# Altium project JacdacRgbBar8Ec30 122.PrjPCB
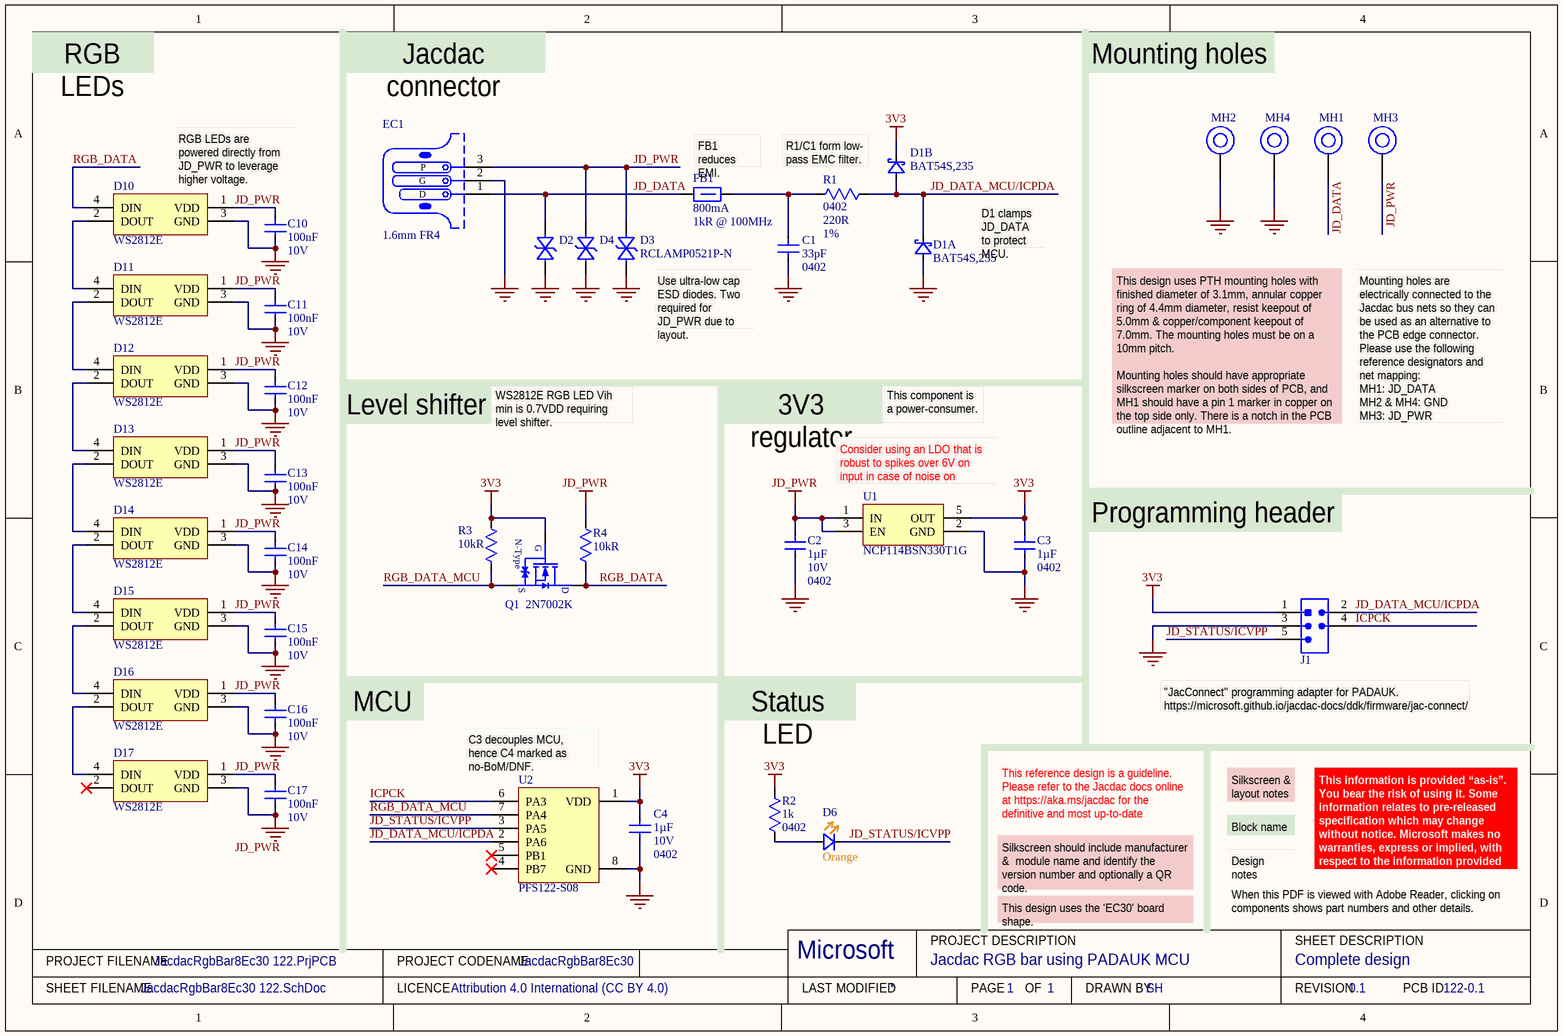
[diagram p0: JacdacRgbBar8Ec30 122.SchDoc]
ProjectCodeName: JacdacRgbBar8Ec30; ProjectCodenameDescription: Jacdac RGB bar using PADAUK MCU; ProjectCodenameID: 122; ProjectDrawnBy: SH; ProjectLicenceTerms: Attribution 4.0 International (CC BY 4.0); ProjectRevision: 0.1
1 sheet, 39 parts. Net scope: global (net labels, ports and power ports of the same name join across sheets).
Board files: JacdacRgbBar8Ec30 122.PcbDoc, JacdacRgbBar8Ec30 alt 1 122.PcbDoc

## Sheet JacdacRgbBar8Ec30 122.SchDoc: Complete design
size A4; DrawnBy: SH; DocumentNumber: 1; Revision: 0.1; SheetNumber: 1; SheetTotal: 1; VersionControl_RevNumber: 1

### Parts
C1  Case Code (Imperial): 0402  Capacitance: 33pF  [C0402_0.55MM - without outline]  (hidden comment: CL05C330JB5NNNC)
C2  Capacitance: 1µF  Voltage Rating: 10V  Case Code (Imperial): 0402  [C0402_0.55MM - without outline]  (hidden comment: CL05A105KP5NNNC)
C3  Capacitance: 1µF  Case Code (Imperial): 0402  [C0402_0.55MM - without outline]  (hidden comment: CL05A105KP5NNNC)
C4  Capacitance: 1µF  Voltage Rating: 10V  Case Code (Imperial): 0402  [C0402_0.55MM - without outline]  (hidden comment: CL05A105KP5NNNC)  (no BOM)
C10  Capacitance: 100nF  Voltage Rating: 10V  [C0402_0.55MM - without outline]  (hidden comment: CL05B104KP5NNNC)
C11  Capacitance: 100nF  Voltage Rating: 10V  [C0402_0.55MM - without outline]  (hidden comment: CL05B104KP5NNNC)
C12  Capacitance: 100nF  Voltage Rating: 10V  [C0402_0.55MM - without outline]  (hidden comment: CL05B104KP5NNNC)
C13  Capacitance: 100nF  Voltage Rating: 10V  [C0402_0.55MM - without outline]  (hidden comment: CL05B104KP5NNNC)
C14  Capacitance: 100nF  Voltage Rating: 10V  [C0402_0.55MM - without outline]  (hidden comment: CL05B104KP5NNNC)
C15  Capacitance: 100nF  Voltage Rating: 10V  [C0402_0.55MM - without outline]  (hidden comment: CL05B104KP5NNNC)
C16  Capacitance: 100nF  Voltage Rating: 10V  [C0402_0.55MM - without outline]  (hidden comment: CL05B104KP5NNNC)
C17  Capacitance: 100nF  Voltage Rating: 10V  [C0402_0.55MM - without outline]  (hidden comment: CL05B104KP5NNNC)
D1  Manufacturer Part Number: BAT54S,235  [NXP-BAT54S-TO-236AB - without outline]  (hidden comment: BAT54S)  (parts A,B of 2)
D2  RCLAMP0521P-N  [TVS 0402 - XL]  (value not drawn)
D3  RCLAMP0521P-N  [TVS 0402 - XL]
D4  RCLAMP0521P-N  [TVS 0402 - XL]  (value not drawn)
D6  Colour: Orange  [0603 Orange - without outline]  (hidden comment: 19-217/S2C-AQ1R1B/3T)
D10  WS2812E  [WS2812E-5050]
D11  WS2812E  [WS2812E-5050]
D12  WS2812E  [WS2812E-5050]
D13  WS2812E  [WS2812E-5050]
D14  WS2812E  [WS2812E-5050]
D15  WS2812E  [WS2812E-5050]
D16  WS2812E  [WS2812E-5050]
D17  WS2812E  [WS2812E-5050]
EC1  PCB Type: 1.6mm FR4  [JACDAC_EDGE_CONNECTOR_NO_TRACES]  (hidden comment: 3 pin JACDAC edge connector)  (no BOM)
FB1  Current Rating: 800mA  Impedance: 1kR @ 100MHz  [TDK MPZ1608 0.8mm - without outline]  (hidden comment: TDK MPZ1608S102ATA00)
J1  Hack Connect Mini 1.27 mm pitch 2-row  [HACK_CONNECT_MINI_5_X_1_27_0.559mm_TH]  (value not drawn)  (no BOM)
MH1  MH_7.0MMK_4.4MMC_3.1MMD_PTH  [MH_7.0MMK_4.4MMC_3.1MMD_PTH]  (value not drawn)  (no BOM)
MH2  MH_7.0MMK_4.4MMC_3.1MMD_PTH  [MH_7.0MMK_4.4MMC_3.1MMD_PTH]  (value not drawn)  (no BOM)
MH3  MH_7.0MMK_4.4MMC_3.1MMD_PTH  [MH_7.0MMK_4.4MMC_3.1MMD_PTH]  (value not drawn)  (no BOM)
MH4  MH_7.0MMK_4.4MMC_3.1MMD_PTH  [MH_7.0MMK_4.4MMC_3.1MMD_PTH]  (value not drawn)  (no BOM)
Q1  2N7002K  [SOT-23]
R1  Case Code (Imperial): 0402  Resistance: 220R  Tolerance: 1%  [R0402 - Without outline]  (hidden comment: RC0402FR-07220RL)
R2  Case Code (Imperial): 0402  Resistance: 1k  [R0402 - Without outline]  (hidden comment: RC0402FR-071KL)
R3  Resistance: 10kR  [R0402 - Without outline]  (hidden comment: 10k)
R4  Resistance: 10kR  [R0402 - Without outline]  (hidden comment: 10k)
U1  LDO 3.3V/300 mA  [ON_SEMI-SOT23-5 - without outline]  (value not drawn)
U2  PFS122-S08  [SOP-8]

### Nets
3V3: C3.2 C4.2 D1.2(K) J1.1(VCC) Q1.1(G) R2.2 R3.1 U1.5(OUT) U2.1(VDD)
GND: C1.1 C2.1 C3.1 C4.1 C10.1 C11.1 C12.1 C13.1 C14.1 C15.1 C16.1 C17.1 D1.1(A) D2.2(A) D3.2(A) D4.2(A) D10.3(GND) D11.3(GND) D12.3(GND) D13.3(GND) D14.3(GND) D15.3(GND) D16.3(GND) D17.3(GND) EC1.2(G) J1.3(GND) MH2.1 MH4.1 U1.2(GND) U2.8(GND)
JD_PWR: C2.2 C10.2 C11.2 C12.2 C13.2 C14.2 C15.2 C16.2 C17.2 D3.1(K) D4.1(K) D10.1(VDD) D11.1(VDD) D12.1(VDD) D13.1(VDD) D14.1(VDD) D15.1(VDD) D16.1(VDD) D17.1(VDD) EC1.3(P) MH3.1 R4.1 U1.1(IN) U1.3(EN)
ICPCK: J1.4(SWCLK) U2.6(PA3)
JD_DATA: D2.1(K) EC1.1(D) FB1.1 MH1.1
JD_DATA_MCU/ICPDA: D1.3(K) J1.2(SWDIO) R1.1 U2.2(PA6)
JD_STATUS/ICVPP: D6.1(K) J1.5(RESET) U2.3(PA5)
RGB_DATA: D10.4(DIN) Q1.3(D) R4.2
RGB_DATA_MCU: Q1.2(S) R3.2 U2.7(PA4)
NetC1_2: C1.2 FB1.2 R1.2
NetD6_2: D6.2(A) R2.1
NetD10_2: D10.2(DOUT) D11.4(DIN)
NetD11_2: D11.2(DOUT) D12.4(DIN)
NetD12_2: D12.2(DOUT) D13.4(DIN)
NetD13_2: D13.2(DOUT) D14.4(DIN)
NetD14_2: D14.2(DOUT) D15.4(DIN)
NetD15_2: D15.2(DOUT) D16.4(DIN)
NetD16_2: D16.2(DOUT) D17.4(DIN)

Not connected (* = marked no-connect by the designer): D17 2(DOUT)*; U2 4(PB7)* 5(PB1)*

### Notes on the sheet
- RGB LEDs
- Jacdac connector
- Mounting holes
- RGB LEDs are powered directly from JD_PWR to leverage higher voltage.
- (near FB1) FB1 reduces EMI.
- R1/C1 form low- pass EMC filter.
- D1 clamps JD_DATA to protect MCU.
- Use ultra-low cap ESD diodes. Two required for JD_PWR due to layout.
- Mounting holes are electrically connected to the Jacdac bus nets so they can be used as an alternative to the PCB edge connector. Please use the following reference designators and net mapping:
- Level shifter
- WS2812E RGB LED Vih min is 0.7VDD requiring level shifter.
- 3V3 regulator
- This component is a power-consumer.
- This design uses PTH mounting holes with finished diameter of 3.1mm, annular copper ring of 4.4mm diameter, resist keepout of 5.0mm & copper/component keepout of 7.0mm. The mounting holes must be on a 10mm pitch.
  Mounting holes should have appropriate silkscreen marker on both sides of PCB, and MH1 should have a pin 1 marker in copper on the top side only. There is a notch in the PCB outline adjacent to MH1.
- MH1: JD_DATA
  MH2 & MH4: GND
  MH3: JD_PWR
- (near U1) Consider using an LDO that is robust to spikes over 6V on input in case of noise on JD_PWR.
- Programming header
- MCU
- Status LED
- (near J1) "JacConnect" programming adapter for PADAUK.
  https://microsoft.github.io/jacdac-docs/ddk/firmware/jac-connect/
- (near U2) C3 decouples MCU, hence C4 marked as no-BoM/DNF.
- This reference design is a guideline. Please refer to the Jacdac docs online at https://aka.ms/jacdac for the definitive and most up-to-date information.
- Block name
- Silkscreen & layout notes
- This design uses the 'EC30' board shape.
- Silkscreen should include manufacturer &  module name and identify the version number and optionally a QR code.
- Design notes
- When this PDF is viewed with Adobe Reader, clicking on components shows part numbers and other details.
- This information is provided “as-is”. You bear the risk of using it. Some information relates to pre-released specification which may change without notice. Microsoft makes no warranties, express or implied, with respect to the information provided here.
- Labels drawn without touching a wire or pin: JD_PWR
- PROJECT FILENAME
- PROJECT CODENAME
- Microsoft
- PROJECT DESCRIPTION
- SHEET DESCRIPTION
- SHEET FILENAME
- LICENCE
- LAST MODIFIED
- PAGE
- OF
- DRAWN BY
- REVISION
- PCB ID
- (in symbol 2N7002K (2)) N-Type

### Library data of the parts
C1 = CL05C330JB5NNNC: CAP CER 33PF 50V C0G/NP0 0402; Manufacturer: Samsung; Material: Ceramic; Tolerance: 5%; Dielectric: C0G; Temperature Coefficient: 300ppm/°C; Supplier 1: Digi-Key; Manufacturer Part Number: CL05C330JB5NNNC; RoHS: Yes; Category: Ceramic Capacitors; Stock 1: 5436088; Pricing 1: 1=0.10000, 10=0.02300, 50=0.01260, 100=0.01040, 500=0.00740, 1000=0.00582, 2500=0.00529, 5000=0.00487 (USD); Mount: Surface Mount; Case Code (Metric): 1005; Contact Plating: Tin; Min Operating Temperature: -55°C; Max Operating Temperature: 125°C; Package Quantity: 1; Packaging: Tape and Reel; Voltage: 50V; Voltage Rating (DC): 50V; Series: CL; Construction: Flat; Length: 1mm; Width: 0.02inch; Height: 0.5mm; Thickness: 0.022inch; Depth: 0.5mm; Radiation Hardening: No; Lead Free: Lead Free; RoHS Compliant: Yes; ComponentLink1URL: https://datasheet.ciiva.com/15195/getdatasheetpartid-355282-15195687.pdf; ComponentLink1Description: Online datasheet; Supplier 2: Newark; Stock 2: 45340; Pricing 2: 1=0.12500, 25=0.02900, 100=0.01300, 250=0.01100, 500=0.00900, 1000=0.00600 (USD); Supplier 3: Mouser; Stock 3: 8877; Pricing 3: 1=0.10000, 10=0.01400, 50=0.01400, 100=0.01100, 1000=0.00600, 10000=0.00400 (USD); Supplier 4: Farnell; Stock 4: 10934; Pricing 4: 150=0.01120, 500=0.00860, 2500=0.00640, 5000=0.00550 (GBP); Supplier Part Number 4: 3013373RL; Supplier Part Number 3: 187-CL05C330JB5NNNC; Supplier Part Number 2: 82AC9259; Supplier Part Number 1: 1276-1272-1-ND; Voltage Rating: 50V; Case/Package: 0402
C2-C4 = CL05A105KP5NNNC: CAP CER 1UF 10V X5R 0402; Manufacturer: Samsung; Material: Ceramic; Tolerance: 10%; Supplier 1: Digi-Key; Manufacturer Part Number: CL05A105KP5NNNC; RoHS: Yes; Category: Capacitors; Stock 1: 5705569; Pricing 1: 1=0.10000, 10=0.03900, 50=0.02100, 100=0.01720, 500=0.01228, 1000=0.00965, 2500=0.00877, 5000=0.00807 (USD); Mount: Surface Mount; Case/Package: 0402; Case Code (Metric): 1005; Contact Plating: Tin; Min Operating Temperature: -55°C; Max Operating Temperature: 85°C; Dielectric: X5R; Package Quantity: 1; Packaging: Tape and Reel; Length: 1mm; Height: 0.5mm; Width: 0.02inch; Thickness: 0.022inch; Depth: 0.5mm; Radiation Hardening: No; ComponentLink1URL: https://datasheet.ciiva.com/15195/getdatasheetpartid-358390-15195630.pdf; ComponentLink1Description: Online datasheet; Supplier 2: Mouser; Stock 2: 928941; Pricing 2: 1=0.10000, 10=0.04200, 100=0.01800, 500=0.01300, 1000=0.01000, 2500=0.00900 (USD); Supplier 3: Farnell; Stock 3: 53670; Pricing 3: 10=0.02450, 100=0.02000, 500=0.01310, 2500=0.00920, 5000=0.00810, 10000=0.00640, 50000=0.00490 (GBP); Supplier Part Number 3: 3013329; Supplier Part Number 2: 187-CL05A105KP5NNNC; Supplier Part Number 1: 1276-1076-1-ND; Created: DG; Checked: ?
  C3: Voltage Rating: 10V
C10-C17 = CL05B104KP5NNNC: CAP CER 0.1UF 10V X7R 0402; Manufacturer: Samsung; Tolerance: 10%; Supplier 1: Digi-Key; Manufacturer Part Number: CL05B104KP5NNNC; RoHS: Yes; Category: Ceramic Capacitors; Stock 1: 17321183; Pricing 1: 1=0.10000, 10=0.02500, 50=0.01380, 100=0.01130, 500=0.00804, 1000=0.00632, 2500=0.00575, 5000=0.00529 (USD); Mount: Surface Mount; Case/Package: 0402; Case Code (Imperial): 0402; Case Code (Metric): 1005; Contact Plating: Tin; Min Operating Temperature: -55°C; Max Operating Temperature: 125°C; Package Quantity: 1; Packaging: Tape and Reel; Dielectric: X7R; Length: 1mm; Width: 0.02inch; Height: 0.5mm; Thickness: 0.022inch; Depth: 0.5mm; Radiation Hardening: No; ComponentLink1URL: https://datasheet.ciiva.com/15165/getdatasheetpartid-37100-15165107.pdf; ComponentLink1Description: Samsung datasheet online; Supplier 2: Mouser; Stock 2: 984124; Pricing 2: 10000=0.00400, 20000=0.00400, 50000=0.00400 (USD); Supplier 3: Farnell; Stock 3: 39022; Pricing 3: 10=0.01620, 100=0.01310, 500=0.00740, 2500=0.00600, 5000=0.00470, 10000=0.00400, 50000=0.00320 (GBP); Supplier 4: Newark; Stock 4: 56730; Pricing 4: 1=0.09000, 25=0.02300, 100=0.01000, 250=0.00900, 500=0.00700, 1000=0.00500, 2500=0.00500 (USD); Supplier 5: Future Electronics; Stock 5: 20877033; Pricing 5: 1=0.00460, 500=0.00340, 1500=0.00320, 2500=0.00310, 5000=0.00300 (USD); Supplier Part Number 5: 9032525; Supplier Part Number 4: 82AC9219; Supplier Part Number 2: 187-CL05B104KP5NNNC; Supplier Part Number 1: 1276-1002-1-ND; Created: DG; Checked: ?; Supplier Part Number 3: 3013351
D1 = BAT54S: DIODE ARRAY SCHOTTKY 30V SOT23; Manufacturer: Nexperia; Supplier 1: Digi-Key; RoHS: No; Category: Rectifier Diodes; Stock 1: 14011; Pricing 1: 1=0.13000, 10=0.11900, 100=0.05610, 500=0.03326, 1000=0.02185, 5000=0.02138 (USD); ComponentLink1URL: https://assets.nexperia.com/documents/data-sheet/BAT54_SER.pdf; ComponentLink1Description: NXP datasheet online; Supplier 2: Mouser; Supplier 3: RSComponents; Supplier Part Number 2: 771-BAT54S235; Supplier Part Number 3: 1707990; Supplier Part Number 1: 1727-1868-1-ND
D2-D4 = RCLAMP0521P-N: Bidirectional 5V (Max) 6V 16V 3.5A (8/20us) 0402 TVS RoHS; Manufacturer: Born Semiconductor; Package: 0402; Created By: D Gakure; Checked By: ?; Supplier1: LCSC; Supplier1 Part Number: C316043; ComponentLink1Description: Online datasheet; ComponentLink1URL: https://datasheet.lcsc.com/szlcsc/Bourne-Semicon-Shenzhen-RCLAMP0521P-N_C316043.pdf; Manufacturer Part Number: RCLAMP0521P-N
D6 = 19-217/S2C-AQ1R1B/3T: LED ORANGE DIFFUSED 1608 SMD; Manufacturer: Everlight Elec; Lens Color: White; Luminous Intensity: 100mcd; Test Current: 25mA; Dominant Wavelength: 605nm; Forward Voltage: 2.05V; Manufacturer Part Number: 19-217/S2C-AQ1R1B/3T; RoHS: Yes; Category: LEDs; Mount: Surface Mount; Case/Package: 0603; Color: Orange; Case Code (Metric): 1608; Case Code (Imperial): 0603; Lens Transparency: Diffused; Length: 1.6mm; Width: 0.8mm; Height: 0.65mm; Lead Free: Lead Free; ComponentLink1URL: https://datasheet.lcsc.com/lcsc/1912171731_Everlight-Elec-19-217-S2C-AQ1R1B-3T_C146215.pdf; ComponentLink1Description: Online datasheet; Supplier 1: LCSC; Supplier 1 Part Number: C146215
D10-D17 = WS2812E-5050: WS2812E 5050 RGB LED WITH INTEGRATED DRIVER; Manufacturer: Worldsemi; Color: Blue,Green,Red; Supplier 1 Part Number 3: C139127; RoHS: Yes; Category: LEDs; Mount: Surface Mount; Length: 5mm; Width: 5mm; ComponentLink1URL: https://datasheet.lcsc.com/lcsc/1811151230_Worldsemi-WS2812E_C139127.pdf; ComponentLink1Description: Online datasheet; Supplier 1: LCSC; Manufacturer Part Number: WS2812E
EC1 = Jacdac edge connector: 3 pin Jacdac edge connector 1.27mm pitch; Manufacturer Part Number: JACDAC_EDGE_CONNECTOR; Checked By: ?; Created By: D. Gakure; ComponentLink1Description: Yuliang JACDAC cable connector drawing online; ComponentLink1URL: https://github.com/microsoft/jacdac-mdk/blob/main/connector/JACDAC-Connector-by-Yuliang-2020-11-28.pdf; ComponentLink2Description: JACDAC PCB edge connector spec onlin; ComponentLink2URL: https://github.com/microsoft/jacdac-mdk/blob/main/connector/JACDAC_PCB_Edge_Connector_Drawing_JD-PEC-01_rev_01.pdf
FB1 = TDK MPZ1608S102ATA00: 0603 1k@100MHz 0.8A chip; Core Material: Ferrite; Tolerance: 25%; DC Resistance (DCR): 300mR; Supplier 1: Digi-Key; Stock 1: 113542; Pricing 1: 1=0.1, 10=0.079, 25=0.0716, 50=0.0644, 100=0.0472, 250=0.03432, 500=0.03146, 1000=0.02717 (USD); Mount: Surface Mount; Case/Package: 0603; Case Code (Metric): 1608; Case Code (Imperial): 0603; Package Quantity: 4000; Packaging: Tape and Reel; Max DC Current: 800mA; Length: 0.063inch; Height: 0.037inch; Width: 0.031inch; ComponentLink2URL: https://www.mouser.co.uk/datasheet/2/400/eads_commercial_power_mpz1608_en-923650.pdf; ComponentLink2Description: datasheet online; Supplier 2: Mouser; ComponentLink3Description: datasheet; ComponentLink3URL: Y:\System\Altium\Libraries 2014\TDK\Datasheets\eads_commercial_power_mpz1608_en-923650.pdf; Supplier Part Number 1: 445-8694-1-ND; Supplier Part Number 2: 810-MPZ1608S102ATA00; Manufacturer: TDK; Manufacturer Part Number: MPZ1608S102ATA00
J1 = HACK_CONNECT_MINI
MH1-MH4 = MH_7.0MMK_4.4MMC_3.1MMD_PTH: Mounting Hole 7.0mm keepout, 4.4mm annualar ring and 3.1mm Drill PTH; Hole Size: M3; Hole Diameter: 3.1mm; Hole Type: PTH; Annular Ring: 4.4mm; Hole Clearance: 7.0mm
Q1 = 2N7002K (2): MOSFET Transistor, N Channel, 300 mA, 60 V, 2 ohm, 10 V, 2.5 V; Manufacturer: ON Semiconductor / Fairchild; Continuous Drain Current (ID): 300mA; Power Dissipation: 350mW; Gate to Source Voltage (Vgs): 20V; Input Capacitance: 50pF; Drain to Source Resistance: 2R; Turn-Off Delay Time: 30ns; Drain to Source Breakdown Voltage: 60V; Number of Elements: 1; Turn-On Delay Time: 5ns; Element Configuration: Single; Threshold Voltage: 2.5V; Polarity: N-CHANNEL; Supplier 1: Digi-Key; RoHS: Yes; Category: MOSFETs; Stock 1: 53564; Pricing 1: 1=0.40000, 10=0.32500, 25=0.27240, 100=0.17240, 500=0.11344, 1000=0.07714 (USD); Mount: Surface Mount; Case/Package: SOT-23; Number of Pins: 3; Contact Plating: Tin,Matte; Min Operating Temperature: -55°C; Max Operating Temperature: 150°C; Packaging: Tape and Reel; Max Power Dissipation: 350mW; Package Quantity: 1; Rds On Max: 2R; Drain to Source Voltage (Vdss): 60V; On-State Resistance: 2R; Drain-source On Resistance-Max: 2R; Voltage: 60V; Length: 2.92mm; Width: 1.3mm; Height: 1.2mm; Radiation Hardening: No; Lead Free: Lead Free; REACH SVHC: No SVHC; Supplier 2: Mouser; Stock 2: 111825; Pricing 2: 1=0.40000, 10=0.27300, 50=0.27300, 100=0.13400, 1000=0.07800, 10000=0.05100 (USD); Supplier 3: Farnell; Stock 3: 101059; Pricing 3: 5=0.34800, 10=0.23500, 100=0.09100, 500=0.05850, 3000=0.04630, 9000=0.03860, 24000=0.03750, 45000=0.03530 (GBP); Supplier Part Number 3: 2453382; Supplier Part Number 1: 2N7002KCT-ND; Supplier Part Number 2: 512-2N7002K; Created By: D. Gakure; Checked By: ?; ComponentLink1Description: Online datasheet; ComponentLink1URL: https://www.onsemi.com/pdf/datasheet/2n7002k-d.pdf; Manufacturer Part Number: 2N7002K
R1 = RC0402FR-07220RL: RES SMD 220 OHM 1% 1/16W 0402; Manufacturer: Yageo; Power Rating: 62.5mW; Voltage Rating: 50V; Temperature Coefficient: 100ppm/°C; Max Power Dissipation: 63mW; Supplier 1: Digi-Key; Manufacturer Part Number: RC0402FR-07220RL; RoHS: Yes; Category: Resistors; Stock 1: 1286042; Pricing 1: 1=0.10000, 10=0.01400, 100=0.00580, 1000=0.00262, 2500=0.00228, 5000=0.00188 (USD); Case/Package: 0402; Number of Pins: 2; Case Code (Metric): 1005; Min Operating Temperature: -55°C; Max Operating Temperature: 155°C; Packaging: Tape and Reel; Voltage Rating (DC): 50V; Package Quantity: 1; Termination: SMD/SMT; Resistor Type: Thick Film; Number of Terminations: 2; Features: Moisture Resistant; Length: 1mm; Height: 0.016inch; Width: 0.02inch; Depth: 0.5mm; REACH SVHC: No SVHC; Military Standard: Not; Lead Free: Lead Free; ComponentLink1URL: https://datasheet.ciiva.com/11819/0900766b80c66297-11819466.pdf; ComponentLink1Description: Online datasheet; Supplier 2: Mouser; Stock 2: 324625; Pricing 2: 1=0.10000, 10=0.01200, 100=0.00400, 1000=0.00400, 2500=0.00400, 10000=0.00300 (USD); Supplier 3: Farnell; Stock 3: 18234; Pricing 3: 1=0.08130, 25=0.01210, 100=0.01120, 250=0.01030, 500=0.00900 (GBP); Supplier Part Number 3: 2147864; Supplier Part Number 2: 603-RC0402FR-07220RL; Supplier Part Number 1: 311-220LRCT-ND; Created: D.G; Checked: ?
R2 = RC0402FR-071KL: RES SMD 1K OHM 1% 1/16W 0402; Manufacturer: Yageo; Temperature Coefficient: 100ppm/°C; Voltage Rating (DC): 50V; Power Rating: 62.5mW; Supplier 1: Digi-Key; Manufacturer Part Number: RC0402FR-071KL; RoHS: Yes; Category: Resistors; Stock 1: 37591306; Pricing 1: 1=0.10000, 10=0.01400, 100=0.00580, 1000=0.00262, 2500=0.00228, 5000=0.00188 (USD); Case/Package: 0402; Number of Pins: 2; Case Code (Metric): 1005; Min Operating Temperature: -55°C; Max Operating Temperature: 155°C; Resistor Type: Thick Film; Tolerance: 1%; Packaging: Tape and Reel; Voltage Rating: 50V; Termination: SMD/SMT; Length: 1mm; Height: 0.32mm; Width: 0.5mm; Depth: 0.5mm; REACH SVHC: Unknown; Lead Free: Lead Free; Military Standard: Not; ComponentLink2URL: https://datasheet.ciiva.com/12666/pyu-rc0402-51-rohs-l-6-r-12666741.pdf; ComponentLink2Description: Online datasheet; Supplier 2: Mouser; Stock 2: 11912978; Pricing 2: 1=0.10000, 10=0.01200, 100=0.00400, 1000=0.00400, 2500=0.00400, 10000=0.00300 (USD); Supplier 3: Farnell; Stock 3: 29900; Pricing 3: 1=0.08130, 25=0.01210, 100=0.01120, 250=0.01030, 500=0.00900 (GBP); Supplier Part Number 3: 2132441; Supplier Part Number 2: 603-RC0402FR-071KL; Supplier Part Number 1: 311-1.00KLRDKR-ND; Created: D.G; Checked: ?
R3 R4 = RC0402FR-0710KL: RES SMD 10K OHM 1% 1/16W 0402; Manufacturer: Yageo; Temperature Coefficient: 100ppm/°C; Voltage Rating (DC): 50V; Power Rating: 62.5mW; Supplier 1: Digi-Key; Manufacturer Part Number: RC0402FR-0710KL; RoHS: Yes; Category: Resistors; Stock 1: 40173593; Pricing 1: 1=0.10000, 10=0.01400, 100=0.00580, 1000=0.00262, 2500=0.00228, 5000=0.00188 (USD); Case/Package: 0402; Number of Pins: 2; Case Code (Metric): 1005; Min Operating Temperature: -55°C; Max Operating Temperature: 155°C; Resistor Type: Thick Film; Packaging: Tape and Reel; Voltage Rating: 50V; Termination: SMD/SMT; Working Voltage: 50V; Number of Terminations: 2; Length: 1mm; Height: 0.32mm; Width: 0.5mm; Depth: 0.5mm; Lead Pitch: 0.2mm; REACH SVHC: No SVHC; Lead Free: Lead Free; Military Standard: Not; ComponentLink1URL: https://datasheet.ciiva.com/7660/38568-7660787.pdf?src-supplier=Element14; ComponentLink1Description: https://datasheet.ciiva.com/7660/38568-7660787.pdf?src-supplier=Element14; ComponentLink2URL: https://datasheet.ciiva.com/7849/1784430-7849813.pdf?src-supplier=Element14; ComponentLink2Description: https://datasheet.ciiva.com/7849/1784430-7849813.pdf?src-supplier=Element14; ComponentLink3URL: https://datasheet.ciiva.com/7849/1686128-7849814.pdf?src-supplier=Element14; ComponentLink3Description: https://datasheet.ciiva.com/7849/1686128-7849814.pdf?src-supplier=Element14; ComponentLink4URL: https://datasheet.ciiva.com/7849/1784430-7849815.pdf?src-supplier=Element14; ComponentLink4Description: https://datasheet.ciiva.com/7849/1784430-7849815.pdf?src-supplier=Element14; ComponentLink5URL: https://datasheet.ciiva.com/22747/1018594-22747512.pdf?src-supplier=Element14; ComponentLink5Description: https://datasheet.ciiva.com/22747/1018594-22747512.pdf?src-supplier=Element14; ComponentLink6URL: https://datasheet.ciiva.com/12667/pyu-rc0402-51-rohs-l-6-r-12667067.pdf?src-supplier=Mouser; ComponentLink6Description: https://datasheet.ciiva.com/12667/pyu-rc0402-51-rohs-l-6-r-12667067.pdf?src-supplier=Mouser; ComponentLink7URL: https://datasheet.ciiva.com/7983/1018594-7983486.pdf?src-supplier=Element14; ComponentLink7Description: https://datasheet.ciiva.com/7983/1018594-7983486.pdf?src-supplier=Element14; Supplier 2: Mouser; Stock 2: 23672167; Pricing 2: 1=0.10000, 10=0.01300, 100=0.00400, 1000=0.00300, 2500=0.00300, 10000=0.00200 (USD); Supplier 3: Farnell; Stock 3: 370000; Pricing 3: 10000=0.00350 (GBP); Checked: ?; Created: DG; Supplier Part Number 1: 311-10.0KLRCT-ND; Supplier Part Number 2: 603-RC0402FR-0710KL; Supplier Part Number 3: 2363463; Tolerance: 1%; Case Code (Imperial): 0402
U1 = NCP114BSN330T1G: CMOS Low Dropout Regulator (LDO), 300 mA 3.3V, Non-Active Discharge, TSOP5; Manufacturer: ON Semiconductor; Polarity: Positive; Quiescent Current: 50uA; Max Input Voltage: 5.5V; Min Input Voltage: 1.7V; Max Output Current: 300mA; Number of Outputs: 1; Accuracy: 2%; Output Type: Fixed; Supplier 1: Digi-Key; RoHS: Yes; Category: Voltage Regulators - Linear; Stock 1: 4067; Pricing 1: 1=0.45000, 10=0.33700, 25=0.29440, 100=0.19060, 250=0.15780, 500=0.12624, 1000=0.09679 (USD); Mount: Surface Mount; Case/Package: TSOP; Number of Pins: 5; Min Operating Temperature: -40°C; Max Operating Temperature: 85°C; Output Voltage: 3.3V; Lead Free: Lead Free; RoHS Compliant: Yes; ComponentLink1URL: http://www.farnell.com/datasheets/2118270.pdf?src-supplier=Farnell; ComponentLink1Description: Datasheet (online); Supplier 2: Mouser; Supplier 3: RSComponents; Supplier Part Number 2: 863-NCP114BSN330T1G; Supplier Part Number 3: 1263179; Supplier Part Number 1: NCP114BSN330T1GOSCT-ND; Manufacturer Part Number: NCP114BSN330T1G
U2 = PFS122-SO8: 8bit MTP MCU with 12-bit ADC; Manufacturer: PADAUK; ComponentLink1Description: Online datasheet; ComponentLink1URL: http://www.padauk.com.tw/upload/doc/PFS122%20datasheet_EN_V001_20220518.pdf; Package: SOP-8; Manufacturer Part Number: PFS122-S08

## Assembly variants
consolidate decoupling caps: not fitted C4 C19; alternate parts R1 -> 0402WGF2200TCE